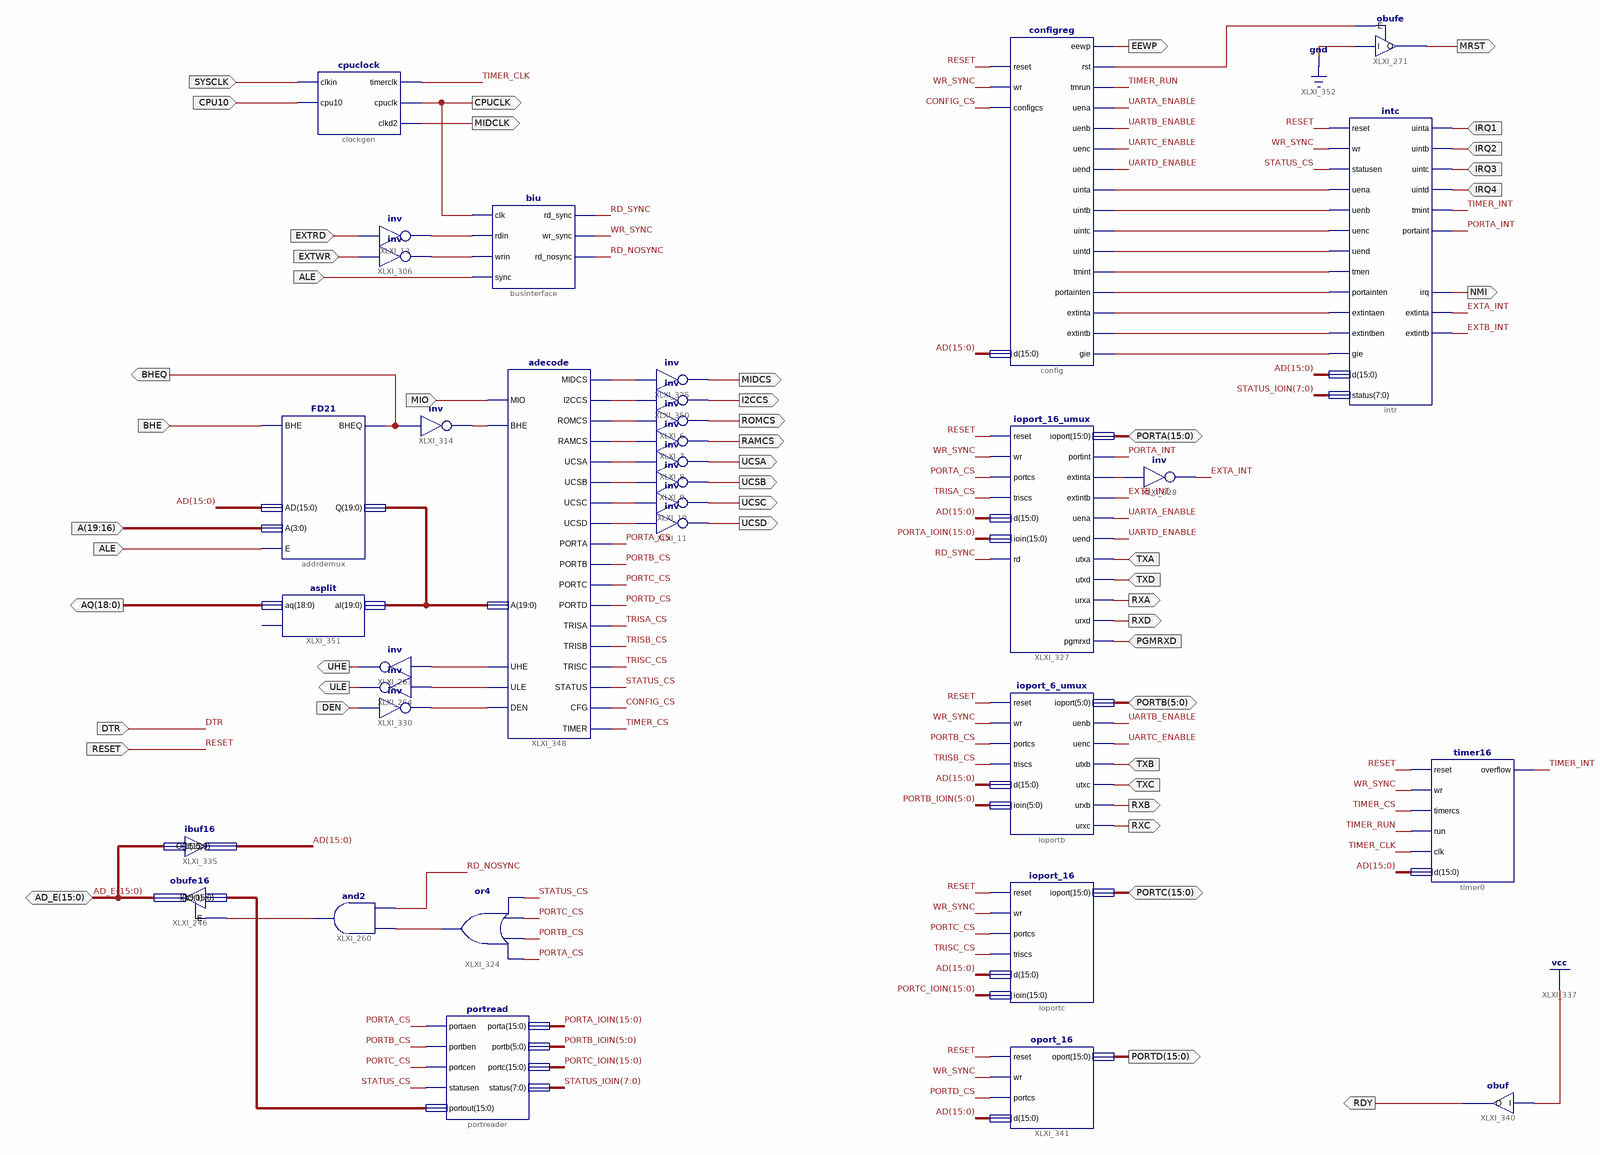
[diagram p0: schematic sheet 1]
// Xilinx ISE schematic main.sch (xc9500) as structural Verilog: 34 symbols, 47 ports
module main (
  input  ALE,
  input  RESET,
  input  EXTWR,
  input  EXTRD,
  input  SYSCLK,
  input  CPU10,
  input  BHE,
  input  [19:16] A,
  input  MIO,
  input  IRQ1,
  input  IRQ4,
  input  IRQ3,
  input  IRQ2,
  input  TXA,
  input  TXD,
  input  PGMRXD,
  input  TXB,
  input  TXC,
  input  DEN,
  input  DTR,
  inout  [15:0] AD_E,
  inout  [15:0] PORTC,
  inout  [15:0] PORTA,
  inout  [5:0] PORTB,
  output MIDCLK,
  output CPUCLK,
  output BHEQ,
  output MIDCS,
  output NMI,
  output EEWP,
  output MRST,
  output RXA,
  output RXD,
  output [15:0] PORTD,
  output RXB,
  output RXC,
  output ULE,
  output UHE,
  output RDY,
  output ROMCS,
  output RAMCS,
  output UCSA,
  output UCSB,
  output UCSC,
  output UCSD,
  output I2CCS,
  output [18:0] AQ
);

  wire CONFIG_CS, EXTA_INT, EXTB_INT, PORTA_CS, PORTA_INT, PORTB_CS, PORTC_CS, PORTD_CS, RD_NOSYNC, RD_SYNC,
       STATUS_CS, TIMER_CLK, TIMER_CS, TIMER_INT, TIMER_RUN, TRISA_CS, TRISB_CS, TRISC_CS, UARTA_ENABLE,
       UARTB_ENABLE, UARTC_ENABLE, UARTD_ENABLE, WR_SYNC, XLXN_19, XLXN_20, XLXN_21, XLXN_22, XLXN_23,
       XLXN_24, XLXN_444, XLXN_451, XLXN_452, XLXN_2395, XLXN_2401, XLXN_2461, XLXN_2464, XLXN_2860,
       XLXN_2861, XLXN_2862, XLXN_2863, XLXN_2864, XLXN_2865, XLXN_2866, XLXN_2867, XLXN_2872, XLXN_3045,
       XLXN_3053, XLXN_3125, XLXN_3157, XLXN_3158;
  wire [5:0] PORTB_IOIN;
  wire [7:0] STATUS_IOIN;
  wire [15:0] AD, PORTA_IOIN, PORTC_IOIN, XLXN_255;
  wire [19:0] AL;

  obufe16 XLXI_246 (.E(XLXN_3125), .I(XLXN_255), .O(AD_E));
  ibuf16 XLXI_335 (.I(AD_E), .O(AD));
  and XLXI_260 (XLXN_3125, RD_NOSYNC, XLXN_2461);
  or XLXI_324 (XLXN_2461, PORTA_CS, PORTB_CS, PORTC_CS, STATUS_CS);
  portread portreader (
    .portaen(PORTA_CS), .portben(PORTB_CS), .portcen(PORTC_CS), .statusen(STATUS_CS), .porta(PORTA_IOIN),
    .portb(PORTB_IOIN), .portc(PORTC_IOIN), .status(STATUS_IOIN), .portout(XLXN_255));
  biu businterface (
    .clk(CPUCLK), .rdin(XLXN_2401), .wrin(XLXN_2395), .rd_nosync(RD_NOSYNC), .rd_sync(RD_SYNC),
    .wr_sync(WR_SYNC), .sync(ALE));
  not XLXI_306 (XLXN_2395, EXTWR);
  not XLXI_13 (XLXN_2401, EXTRD);
  cpuclock clockgen (.clkin(SYSCLK), .cpu10(CPU10), .timerclk(TIMER_CLK), .cpuclk(CPUCLK), .clkd2(MIDCLK));
  FD21 addrdemux (.BHE(BHE), .AD(AD), .A(A), .BHEQ(BHEQ), .Q(AL), .E(ALE));
  not XLXI_314 (XLXN_444, BHEQ);
  not XLXI_325 (MIDCS, XLXN_2464);
  configreg \config  (
    .reset(RESET), .wr(WR_SYNC), .configcs(CONFIG_CS), .eewp(EEWP), .rst(XLXN_3158), .tmrun(TIMER_RUN),
    .uena(UARTA_ENABLE), .uenb(UARTB_ENABLE), .uenc(UARTC_ENABLE), .uend(UARTD_ENABLE), .uinta(XLXN_2872),
    .uintb(XLXN_2867), .uintc(XLXN_2866), .uintd(XLXN_2865), .tmint(XLXN_2864), .portainten(XLXN_2863),
    .extinta(XLXN_2862), .extintb(XLXN_2861), .gie(XLXN_2860), .d(AD));
  intc intr (
    .reset(RESET), .wr(WR_SYNC), .statusen(STATUS_CS), .uena(XLXN_2872), .uenb(XLXN_2867), .uenc(XLXN_2866),
    .uend(XLXN_2865), .tmen(XLXN_2864), .portainten(XLXN_2863), .extintaen(XLXN_2862), .extintben(XLXN_2861),
    .gie(XLXN_2860), .uinta(IRQ1), .uintb(IRQ2), .uintc(IRQ3), .uintd(IRQ4), .tmint(TIMER_INT),
    .portaint(PORTA_INT), .extinta(EXTA_INT), .extintb(EXTB_INT), .d(AD), .irq(NMI), .status(STATUS_IOIN));
  obufe XLXI_271 (.E(XLXN_3158), .I(1'b0), .O(MRST));
  timer16 timer0 (
    .reset(RESET), .wr(WR_SYNC), .timercs(TIMER_CS), .run(TIMER_RUN), .overflow(TIMER_INT), .clk(TIMER_CLK),
    .d(AD));
  ioport_16 ioportc (
    .ioport(PORTC), .wr(WR_SYNC), .portcs(PORTC_CS), .triscs(TRISC_CS), .d(AD), .ioin(PORTC_IOIN),
    .reset(RESET));
  ioport_16_umux XLXI_327 (
    .reset(RESET), .wr(WR_SYNC), .rd(RD_SYNC), .portcs(PORTA_CS), .triscs(TRISA_CS), .d(AD), .ioport(PORTA),
    .ioin(PORTA_IOIN), .extinta(XLXN_3045), .extintb(EXTB_INT), .portint(PORTA_INT), .utxa(TXA), .utxd(TXD),
    .uena(UARTA_ENABLE), .uend(UARTD_ENABLE), .urxa(RXA), .urxd(RXD), .pgmrxd(PGMRXD));
  not XLXI_328 (EXTA_INT, XLXN_3045);
  ioport_6_umux ioportb (
    .reset(RESET), .wr(WR_SYNC), .portcs(PORTB_CS), .triscs(TRISB_CS), .utxb(TXB), .utxc(TXC),
    .uenb(UARTB_ENABLE), .uenc(UARTC_ENABLE), .d(AD), .ioport(PORTB), .urxb(RXB), .urxc(RXC),
    .ioin(PORTB_IOIN));
  not XLXI_263 (UHE, XLXN_451);
  not XLXI_264 (ULE, XLXN_452);
  not XLXI_330 (XLXN_3053, DEN);
  obuf XLXI_340 (.I(1'b1), .O(RDY));
  oport_16 XLXI_341 (.reset(RESET), .wr(WR_SYNC), .portcs(PORTD_CS), .d(AD), .oport(PORTD));
  not XLXI_10 (UCSC, XLXN_23);
  not XLXI_9 (UCSB, XLXN_22);
  not XLXI_7 (RAMCS, XLXN_20);
  not XLXI_8 (UCSA, XLXN_21);
  not XLXI_11 (UCSD, XLXN_24);
  not XLXI_6 (ROMCS, XLXN_19);
  adecode XLXI_348 (
    .MIO(MIO), .BHE(XLXN_444), .DEN(XLXN_3053), .A(AL), .MIDCS(XLXN_2464), .UHE(XLXN_451), .ULE(XLXN_452),
    .I2CCS(XLXN_3157), .ROMCS(XLXN_19), .RAMCS(XLXN_20), .UCSA(XLXN_21), .UCSB(XLXN_22), .UCSC(XLXN_23),
    .UCSD(XLXN_24), .STATUS(STATUS_CS), .CFG(CONFIG_CS), .PORTA(PORTA_CS), .PORTB(PORTB_CS),
    .PORTC(PORTC_CS), .PORTD(PORTD_CS), .TRISA(TRISA_CS), .TRISB(TRISB_CS), .TRISC(TRISC_CS), .TIMER(TIMER_CS));
  not XLXI_350 (I2CCS, XLXN_3157);
  asplit XLXI_351 (.al(AL), .aq(AQ));  // open: a19
endmodule
